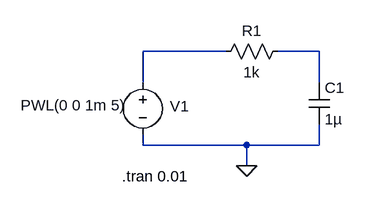
[diagram p0: schematic RC Series Circuit.asc]
RC Series Circuit.asc, the LTspice schematic file:
Version 4
SHEET 1 880 680
WIRE 192 96 64 96
WIRE 336 96 272 96
WIRE 64 144 64 96
WIRE 336 144 336 96
WIRE 64 240 64 224
WIRE 224 240 64 240
WIRE 336 240 336 208
WIRE 336 240 224 240
WIRE 224 272 224 240
FLAG 224 272 0
SYMBOL cap 320 144 R0
SYMATTR InstName C1
SYMATTR Value 1µ
SYMBOL res 288 80 R90
WINDOW 0 0 56 VBottom 2
WINDOW 3 32 56 VTop 2
SYMATTR InstName R1
SYMATTR Value 1k
SYMBOL voltage 64 128 R0
WINDOW 0 42 52 Left 2
WINDOW 3 -188 51 Left 2
WINDOW 123 0 0 Left 0
WINDOW 39 0 0 Left 0
SYMATTR InstName V1
SYMATTR Value PWL(0 0 1m 5)
TEXT 32 288 Left 2 !.tran 0.01

The netlist it stands for:
* RC Series Circuit.asc
C1 N002 0 1µ
R1 N002 N001 1k
V1 N001 0 PWL(0 0 1m 5)
.tran 0.01
.backanno
.end